# EAGLE schematic MicrocontrollerV1 (EAGLE 9.5.1)
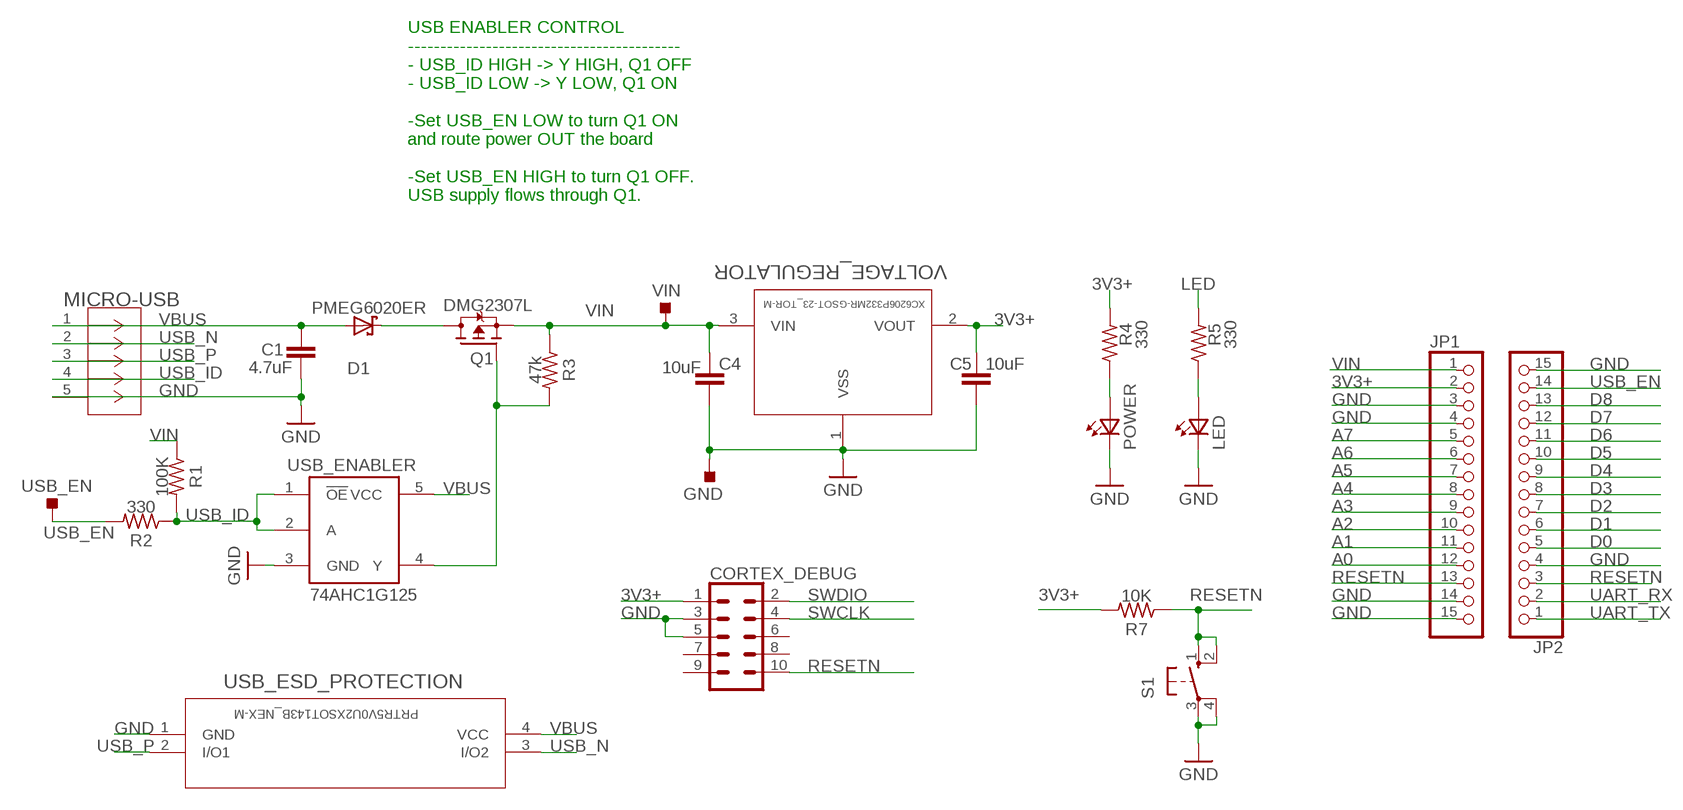
[diagram p0: schematic, sheet 1, part 1 of 2]
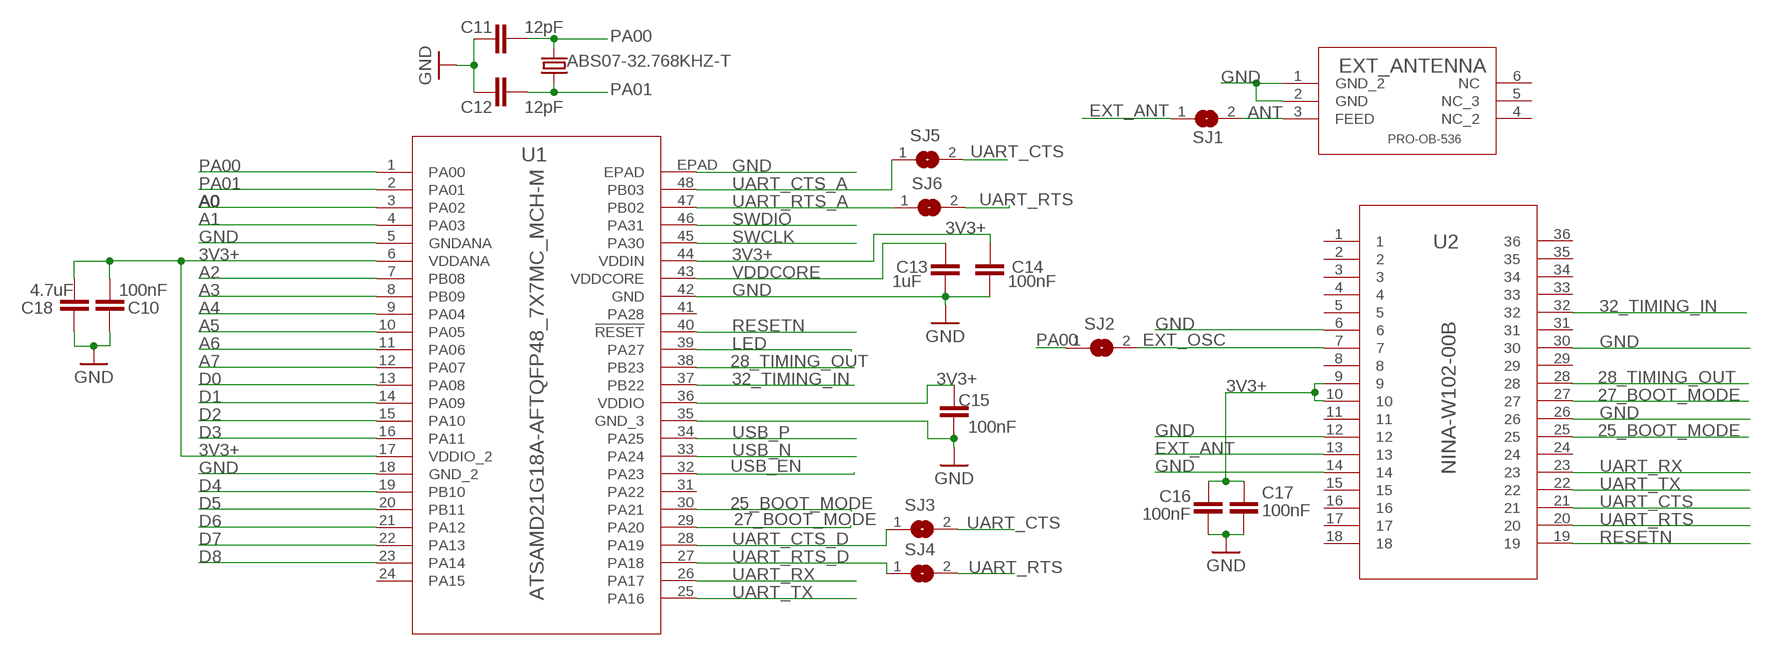
[diagram p1: schematic, sheet 1, part 2 of 2]

## Parts
ABS07-32.768KHZ-T  32.768KHz  ABS07-32.768KHZ-T  [ABS07-32.768KHZ-T]
C1  4.7uF  C_CHIP-0603(1608-METRIC)  [CAPC1608X85]
C4  10uF  C_CHIP-0603(1608-METRIC)  [CAPC1608X85]
C5  10uF  C_CHIP-0603(1608-METRIC)  [CAPC1608X85]
C10  100nF  C_CHIP-0603(1608-METRIC)  [CAPC1608X85]
C11  12pF  C_CHIP-0603(1608-METRIC)  [CAPC1608X85]
C12  12pF  C_CHIP-0603(1608-METRIC)  [CAPC1608X85]
C13  1uF  C_CHIP-0603(1608-METRIC)  [CAPC1608X85]
C14  100nF  C_CHIP-0603(1608-METRIC)  [CAPC1608X85]
C15  100nF  C_CHIP-0603(1608-METRIC)  [CAPC1608X85]
C16  100nF  C_CHIP-0603(1608-METRIC)  [CAPC1608X85]
C17  100nF  C_CHIP-0603(1608-METRIC)  [CAPC1608X85]
C18  4.7uF  C_CHIP-0603(1608-METRIC)  [CAPC1608X85]
CORTEX_DEBUG  CONN_05X2NO_SILK  [2X5_NOSILK]
D1  PMEG6020ER  [SOD123W]
EXT_ANTENNA  PRO-OB-536  [PRO-OB-536_PAB]
GND  TESTPOINT_TPS-SMD-10SN  [TESTPOINT_SMD-10SN]
JP1  PINHD-1X15  [1X15]
JP2  PINHD-1X15  [1X15]
LED  HSMR-C190  [0603]
MICRO-USB  ZX62-AB-5PA(31)  [CONN5_ZX62-AB-5PA_HIR]
POWER  HSMR-C190  [0603]
Q1  DMG2307L  [SOT96P240X110-3N]
R1  100K  R-US_CHIP-0603(1608-METRIC)  [RESC1608X60]
R2  330  R-US_CHIP-0603(1608-METRIC)  [RESC1608X60]
R3  47k  R-US_CHIP-0603(1608-METRIC)  [RESC1608X60]
R4  330  R-US_CHIP-0603(1608-METRIC)  [RESC1608X60]
R5  330  R-US_CHIP-0603(1608-METRIC)  [RESC1608X60]
R7  10K  R-US_CHIP-0603(1608-METRIC)  [RESC1608X60]
S1  PTS525SK08  [SM08]
SJ1  SJ  [SJ]
SJ2  SJ  [SJ]
SJ3  SJ  [SJ]
SJ4  SJ  [SJ]
SJ5  SJ  [SJ]
SJ6  SJ  [SJ]
U1  ATSAMD21G18A-AFTQFP48_7X7MC_MCH-M  [TQFP48_7X7MC_MCH-M]
U2  NINA-W102-00B  [QFN_W151-00B_UBL]
USB_EN  TESTPOINT_TPS-SMD-10SN  [TESTPOINT_SMD-10SN]
USB_ENABLER  74AHC1G125  [SOT23-5L]
USB_ESD_PROTECTION  PRTR5V0U2XSOT143B_NEX-M  [SOT143B_NEX-M]
VIN  TESTPOINT_TPS-SMD-10SN  [TESTPOINT_SMD-10SN]
VOLTAGE_REGULATOR  XC6206P332MR-GSOT-23_TOR-M  [SOT-23_TOR-M]

## Nets
3V3+ [Supply]: C5.1 C10.2 C14.2 C15.2 C16.1 C17.2 C18.2 CORTEX_DEBUG.1 JP1.2 R4.2 R7.2 U1.6(VDDANA) U1.17(VDDIO_2) U1.36(VDDIO) U1.44(VDDIN) U2.9 U2.10 VOLTAGE_REGULATOR.2(VOUT)
25_BOOT_MODE: U1.30(PA21) U2.25
27_BOOT_MODE: U1.29(PA20) U2.27
28_TIMING_OUT: U1.38(PB23) U2.28
32_TIMING_IN: U1.37(PB22) U2.32
A0: JP1.12 U1.3(PA02)
A1: JP1.11 U1.4(PA03)
A2: JP1.10 U1.7(PB08)
A3: JP1.9 U1.8(PB09)
A4: JP1.8 U1.9(PA04)
A5: JP1.7 U1.10(PA05)
A6: JP1.6 U1.11(PA06)
A7: JP1.5 U1.12(PA07)
ANT: EXT_ANTENNA.3(FEED) SJ1.2
D0: JP2.5 U1.13(PA08)
D1: JP2.6 U1.14(PA09)
D2: JP2.7 U1.15(PA10)
D3: JP2.8 U1.16(PA11)
D4: JP2.9 U1.19(PB10)
D5: JP2.10 U1.20(PB11)
D6: JP2.11 U1.21(PA12)
D7: JP2.12 U1.22(PA13)
D8: JP2.13 U1.23(PA14)
EXT_ANT: SJ1.1 U2.13
EXT_OSC: SJ2.2 U2.7
GND [Supply]: C1.2 C4.1 C5.2 C10.1 C11.1 C12.1 C13.1 C14.1 C15.1 C16.2 C17.1 C18.1 CORTEX_DEBUG.3 CORTEX_DEBUG.5 EXT_ANTENNA.1(GND_2) EXT_ANTENNA.2(GND) GND.TP JP1.3 JP1.4 JP1.14 JP1.15 JP2.4 JP2.15 LED.1(K2) MICRO-USB.5 POWER.1(K2) S1.3(P) S1.4(P1) U1.5(GNDANA) U1.18(GND_2) U1.35(GND_3) U1.42(GND) U1.EPAD U2.6 U2.12 U2.14 U2.26 U2.30 USB_ENABLER.3(GND) USB_ESD_PROTECTION.1(GND) VOLTAGE_REGULATOR.1(VSS)
LED: R5.2 U1.39(PA27)
N$1: LED.2(A2) R5.1
N$3: POWER.2(A2) R4.1
N$6: D1.1(K) Q1.3(D)
N$8: Q1.1(G) R3.2 USB_ENABLER.4(Y)
PA00: ABS07-32.768KHZ-T.2 C11.2 SJ2.1 U1.1(PA00)
PA01: ABS07-32.768KHZ-T.1 C12.2 U1.2(PA01)
RESETN: CORTEX_DEBUG.10 JP1.13 JP2.3 R7.1 S1.1(S) S1.2(S1) U1.40(!RESET) U2.19
SWCLK: CORTEX_DEBUG.4 U1.45(PA30)
SWDIO: CORTEX_DEBUG.2 U1.46(PA31)
UART_CTS: SJ3.2 SJ5.2 U2.21
UART_CTS_A: SJ5.1 U1.48(PB03)
UART_CTS_D: SJ3.1 U1.28(PA19)
UART_RTS: SJ4.2 SJ6.2 U2.20
UART_RTS_A: SJ6.1 U1.47(PB02)
UART_RTS_D: SJ4.1 U1.27(PA18)
UART_RX: JP2.2 U1.26(PA17) U2.23
UART_TX: JP2.1 U1.25(PA16) U2.22
USB_EN: JP2.14 R2.2 U1.32(PA23) USB_EN.TP
USB_ID: MICRO-USB.4 R1.2 R2.1 USB_ENABLER.1(!OE) USB_ENABLER.2(A)
USB_N: MICRO-USB.2 U1.33(PA24) USB_ESD_PROTECTION.3(I/O2)
USB_P: MICRO-USB.3 U1.34(PA25) USB_ESD_PROTECTION.2(I/O1)
VBUS [Supply]: C1.1 D1.2(A) MICRO-USB.1 USB_ENABLER.5(VCC) USB_ESD_PROTECTION.4(VCC)
VDDCORE [Supply]: C13.2 U1.43(VDDCORE)
VIN [Supply]: C4.2 JP1.1 Q1.2(S) R1.1 R3.1 VIN.TP VOLTAGE_REGULATOR.3(VIN)
Unconnected: CORTEX_DEBUG.6 CORTEX_DEBUG.7 CORTEX_DEBUG.8 CORTEX_DEBUG.9 EXT_ANTENNA.4(NC_2) EXT_ANTENNA.5(NC_3) EXT_ANTENNA.6(NC) U1.24(PA15) U1.31(PA22) U1.41(PA28) U2.1 U2.2 U2.3 U2.4 U2.5 U2.8 U2.11 U2.15 U2.16 U2.17 U2.18 U2.24 U2.29 U2.31 U2.33 U2.34 U2.35 U2.36

## Notes on the sheet
- USB ENABLER CONTROL
  ------------------------------------------
  - USB_ID HIGH -> Y HIGH, Q1 OFF
  - USB_ID LOW -> Y LOW, Q1 ON
  
  -Set USB_EN LOW to turn Q1 ON 
  and route power OUT the board
  
  -Set USB_EN HIGH to turn Q1 OFF.
  USB supply flows through Q1.

## Library data of the parts
ABS07-32.768KHZ-T = Crystals:ABS07-32.768KHZ-T: CRYSTAL 32.7680KHZ 12.5PF SMD Manufacturer's datasheet <https://abracon.com/Resonators/ABS07.pdf>; CREATED_BY: PCBLayout.com; DIGIKEY_PART_NUMBER: 535-9542-2-ND; MANUFACTURER: Abracon LLC; MPN: ABS07-32.768KHZ-T; PACKAGE: SMD-2
C1 C4 C5 C10-C18 = Capacitor:C: Capacitor - Generic; CATEGORY: Capacitor
CORTEX_DEBUG = SparkFun-Connectors:CONN_05X2: Multi connection point. Often used as Generic Header-pin footprint for 0.1 inch spaced/style header connections For AVR SPI programming port, see special device with nice symbol: "AVR_SPI_PROG_5x2.dev" You can populate with any combo of single row headers, but if you'd like an exact match, check these: 2x5 AVR ICSP Male Header <https://www.sparkfun.com/products/778> (PRT-00778) 2x5 Pin Shrouded Header <https://www.sparkfun.com/products/8506> (PRT-08506) On any of the 0.1 inch spaced packages, you can populate with these: Break Away Headers - Straight <https://www.sparkfun.com/products/116> (PRT-00116) Break Away Male Headers - Right Angle <https://www.sparkfun.com/products/553> (PRT-00553) Female Headers <https://www.sparkfun.com/products/115> (PRT-00115) Break Away Headers - Machine Pin <https://www.sparkfun.com/products/117> (PRT-00117) Break Away Female Headers - Swiss Machine Pin <https://www.sparkfun.com/products/743> (PRT-00743) Special note: the shrouded connector mates well with our 5x2 ribbon cables: 2x5 Pin IDC Ribbon Cable <https://www.sparkfun.com/products/8535> (PRT-08535)
D1 = nxp_60_1_1:PMEG6020: 60V 2A low VF dual MEGA Schottky barrier rectifier Planar Maximum Efficiency General Application (MEGA) Schottky barrier rectifier in common cathode configuration with an integrated guard ring for stress protection, encapsulated in a SOT1061 leadless small Surface-Mounted Device (SMD) plastic package with medium power capability. AAL Eindhoven MK
EXT_ANTENNA = PRO-OB-536 [SMD Antenna]:PRO-OB-536; BUILT_BY: EMA_Cory; COPYRIGHT: Copyright (C) 2018 Accelerated Designs. All rights reserved; MANUFACTURER_PART_NUMBER: PRO-OB-536; SOURCELIBRARY: Proant_2019-12-18; VENDOR: PROANT AB
GND USB_EN VIN = 52101-101-REV-A:TESTPOINT_TPS: TEST POINT PAD; BOM: EXCLUDE
JP1 JP2 = adafruit:PINHD-1X15: PIN HEADER
LED POWER = HSMR-C190:HSMR-C190: http://octopart.com/hsmr-c190-avago-672386; AVAILABILITY: Unavailable; DESCRIPTION: Blue 473nm LED Indication - Discrete 3.4V 0603 (1608 Metric); MF: Broadcom Limited; MP: HSMR-C190; PACKAGE: 0603 Broadcom; PRICE: None
MICRO-USB = ZX62-AB-5PA(31) [Micro-USB 2.0]:ZX62-AB-5PA(31); BUILT_BY: EMA_Justin; COPYRIGHT: Copyright (C) 2016 Accelerated Designs. All rights reserved; MANUFACTURER_PART_NUMBER: ZX62-AB-5PA(31); SOURCELIBRARY: Hirose_2018-12-15; VENDOR: Hirose
Q1 = DMG2307L:DMG2307L: MOSFET, P CH, 30V, 3.8A, SOT23; Transistor Polarity: P Channel; Continuous Drain Current Id: -4.6A; Drain Source Volt...; AVAILABILITY: Unavailable; DESCRIPTION: P-Channel 30V 2.5A (Ta) 760mW (Ta) Surface Mount SOT-23; MF: Diodes Inc.; MP: DMG2307L; PACKAGE: SOT-23-3 Diodes Inc.; PRICE: None
R1-R5 R7 = Resistor:R-US: Resistor Fixed - ANSI; CATEGORY: Resistor; SUB-CATEGORY: Fixed
S1 = pts525_10 [reset switch]:PTS525: PTS 525 Series Miniature Tact Switch for SMD Source: http://www.ck-components.com/14407/pts525_18jul12.pdf/; MF: C&K Components; MPN: PTS525SK08SMTRLFS; OC_FARNELL: unknown; OC_NEWARK: unknown
SJ1-SJ6 = jumper:SJ: SMD solder JUMPER
U1 = ATSAMD21G18A-AF:ATSAMD21G18A-AF; BUILT_BY: EMA_Molly; COPYRIGHT: Copyright (C) 2018 Accelerated Designs. All rights reserved; MANUFACTURER_PART_NUMBER: ATSAMD21G18A-AF; SOURCELIBRARY: Microchip_2019-08-23_25; VENDOR: Microchip
U2 = NINA-W102:NINA-W102-00B; BUILT_BY: EMA_Matt; COPYRIGHT: Copyright (C) 2018 Accelerated Designs. All rights reserved; DATASHEET: https://www.u-blox.com/sites/default/files/NINA-W15_DataSheet_%28UBX-18006647%29.pdf; MANUFACTURER_PART_NUMBER: NINA-W102-00B; SOURCELIBRARY: Ublox_2020-01-16; VENDOR: Ublox
USB_ENABLER = 74AHC1G125:74AHC1G125; AVAILABILITY: Unavailable; DESCRIPTION: Buffer, Non-Inverting 1 Element 1 Bit per Element 3-State Output SOT-23-5; MF: Texas Instruments; MP: 74AHC1G125; PACKAGE: SOT-23 Texas Instruments; PRICE: None
USB_ESD_PROTECTION = PRTR5V0U2X:PRTR5V0U2X; COPYRIGHT: Copyright (C) 2016 Accelerated Designs. All rights reserved; MANUFACTURER_PART_NUMBER: PRTR5V0U2X; SOURCELIBRARY: Nexperia_2018-05-2018; VENDOR: Nexperia
VOLTAGE_REGULATOR = XC6206P332MR (SOT-23) [Vin to 3.3V]:XC6206P332MR-G; BUILT_BY: EMA_UL_Team; MANUFACTURER_PART_NUMBER: XC6206P332MR-G; SOURCELIBRARY: Torex_2016-07-05_2; VENDOR: Torex Semiconductor

## Net classes
1 Supply: width 0.254 mm